# Altium schematic sheet SMC1940-A.SCHDOC
size A2
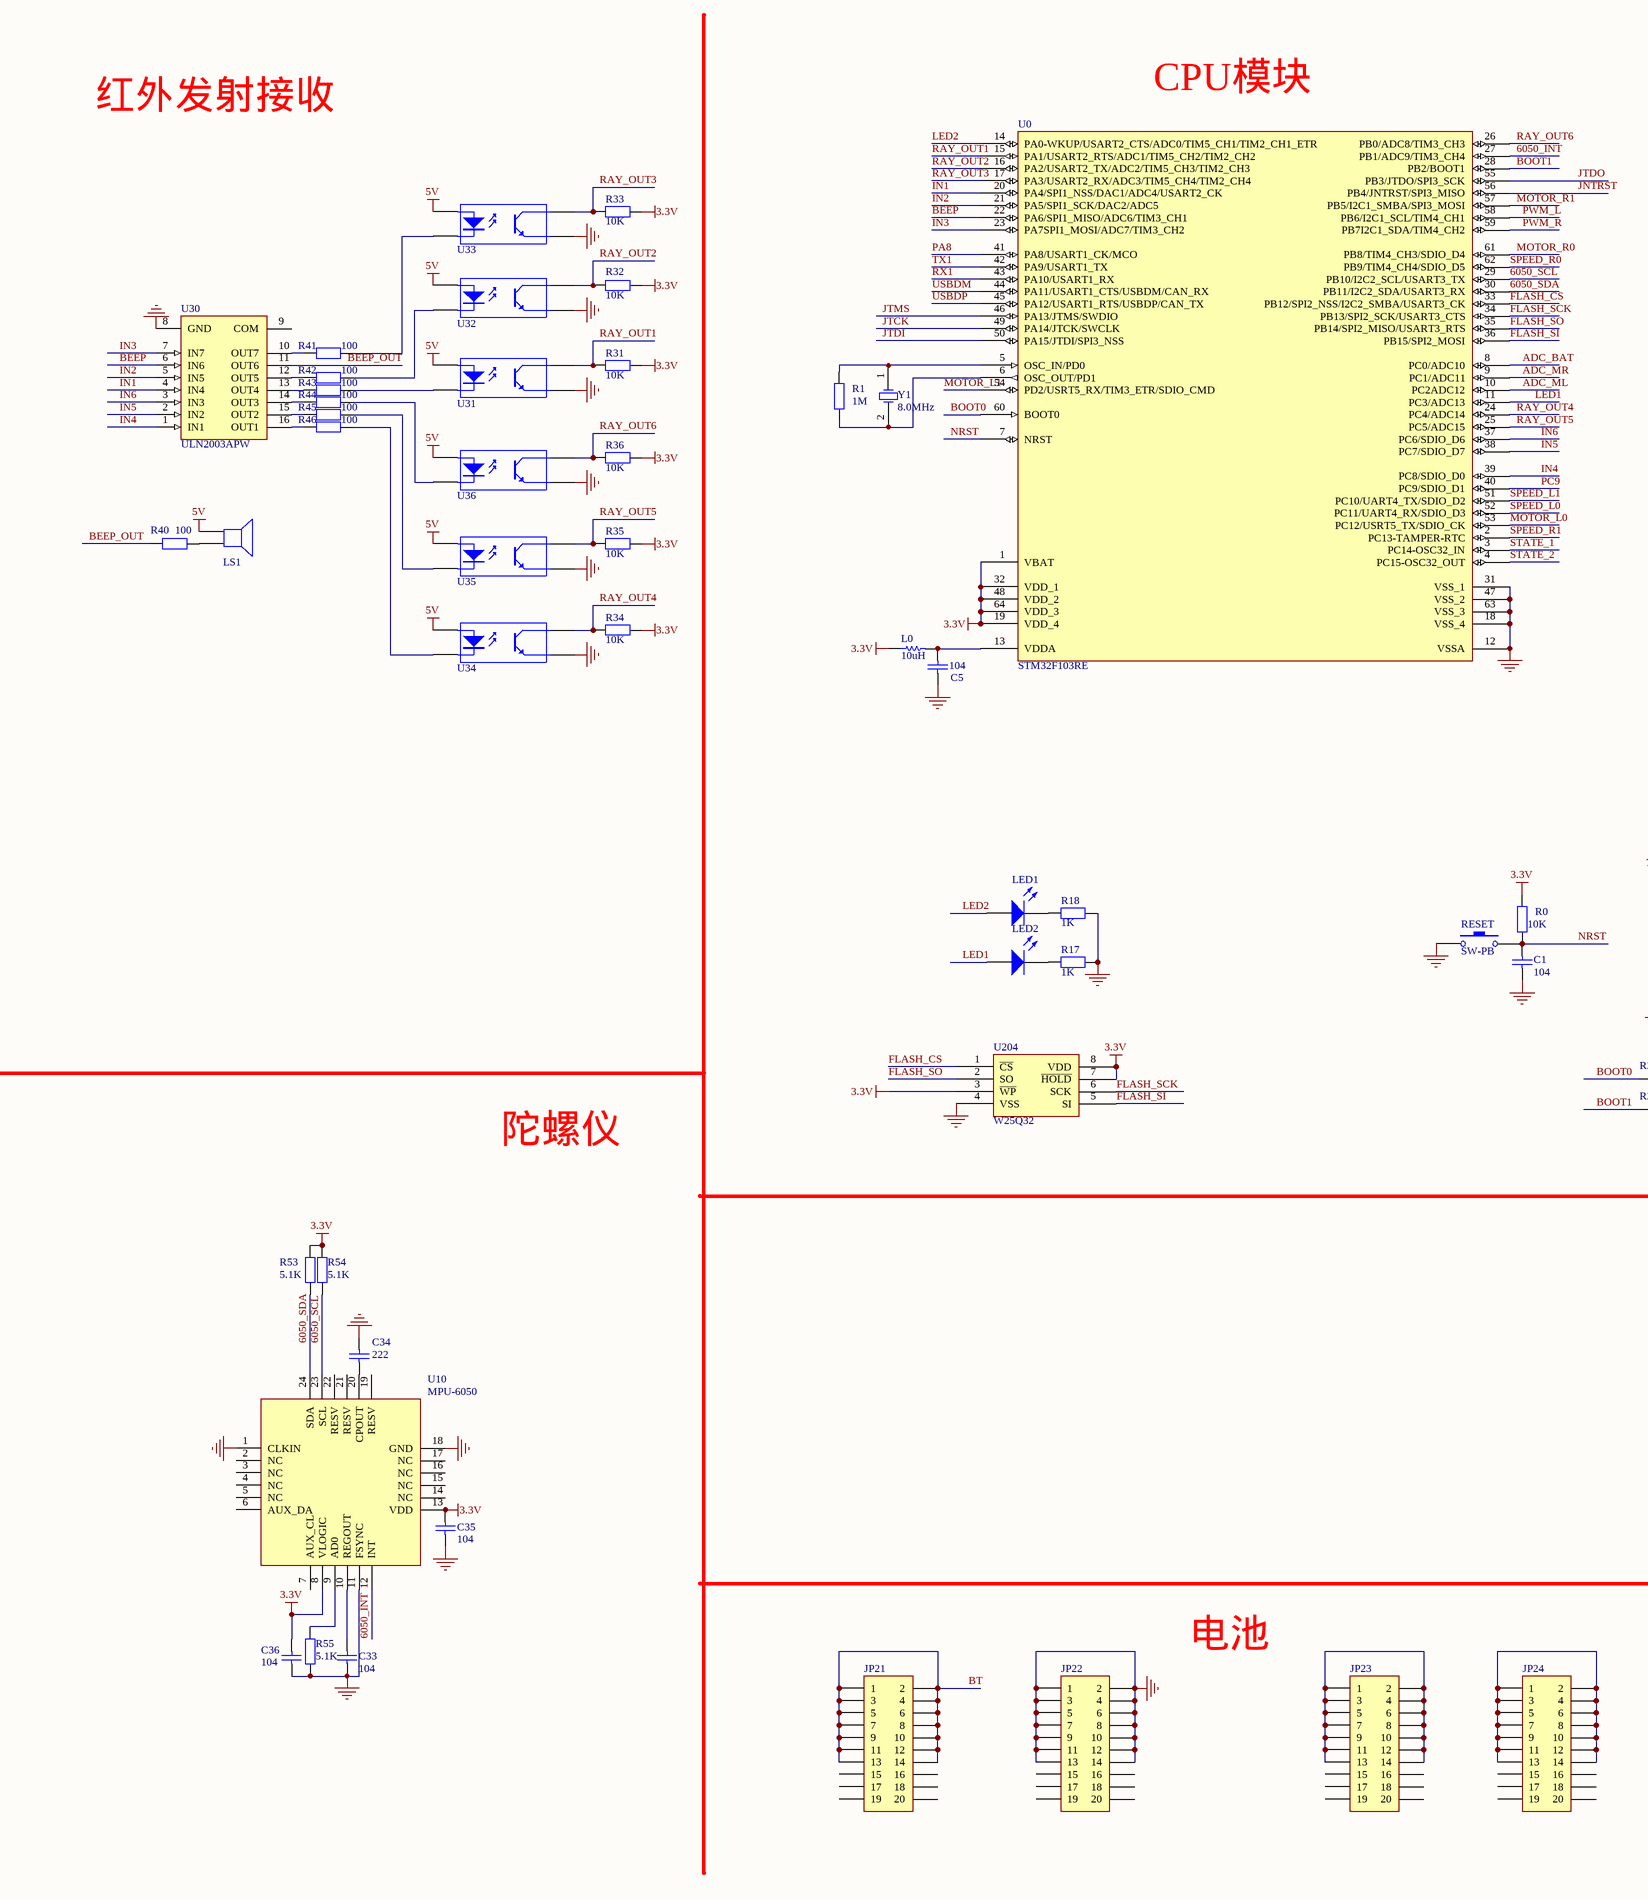
[diagram p0: SMC1940-A.SCHDOC, left]
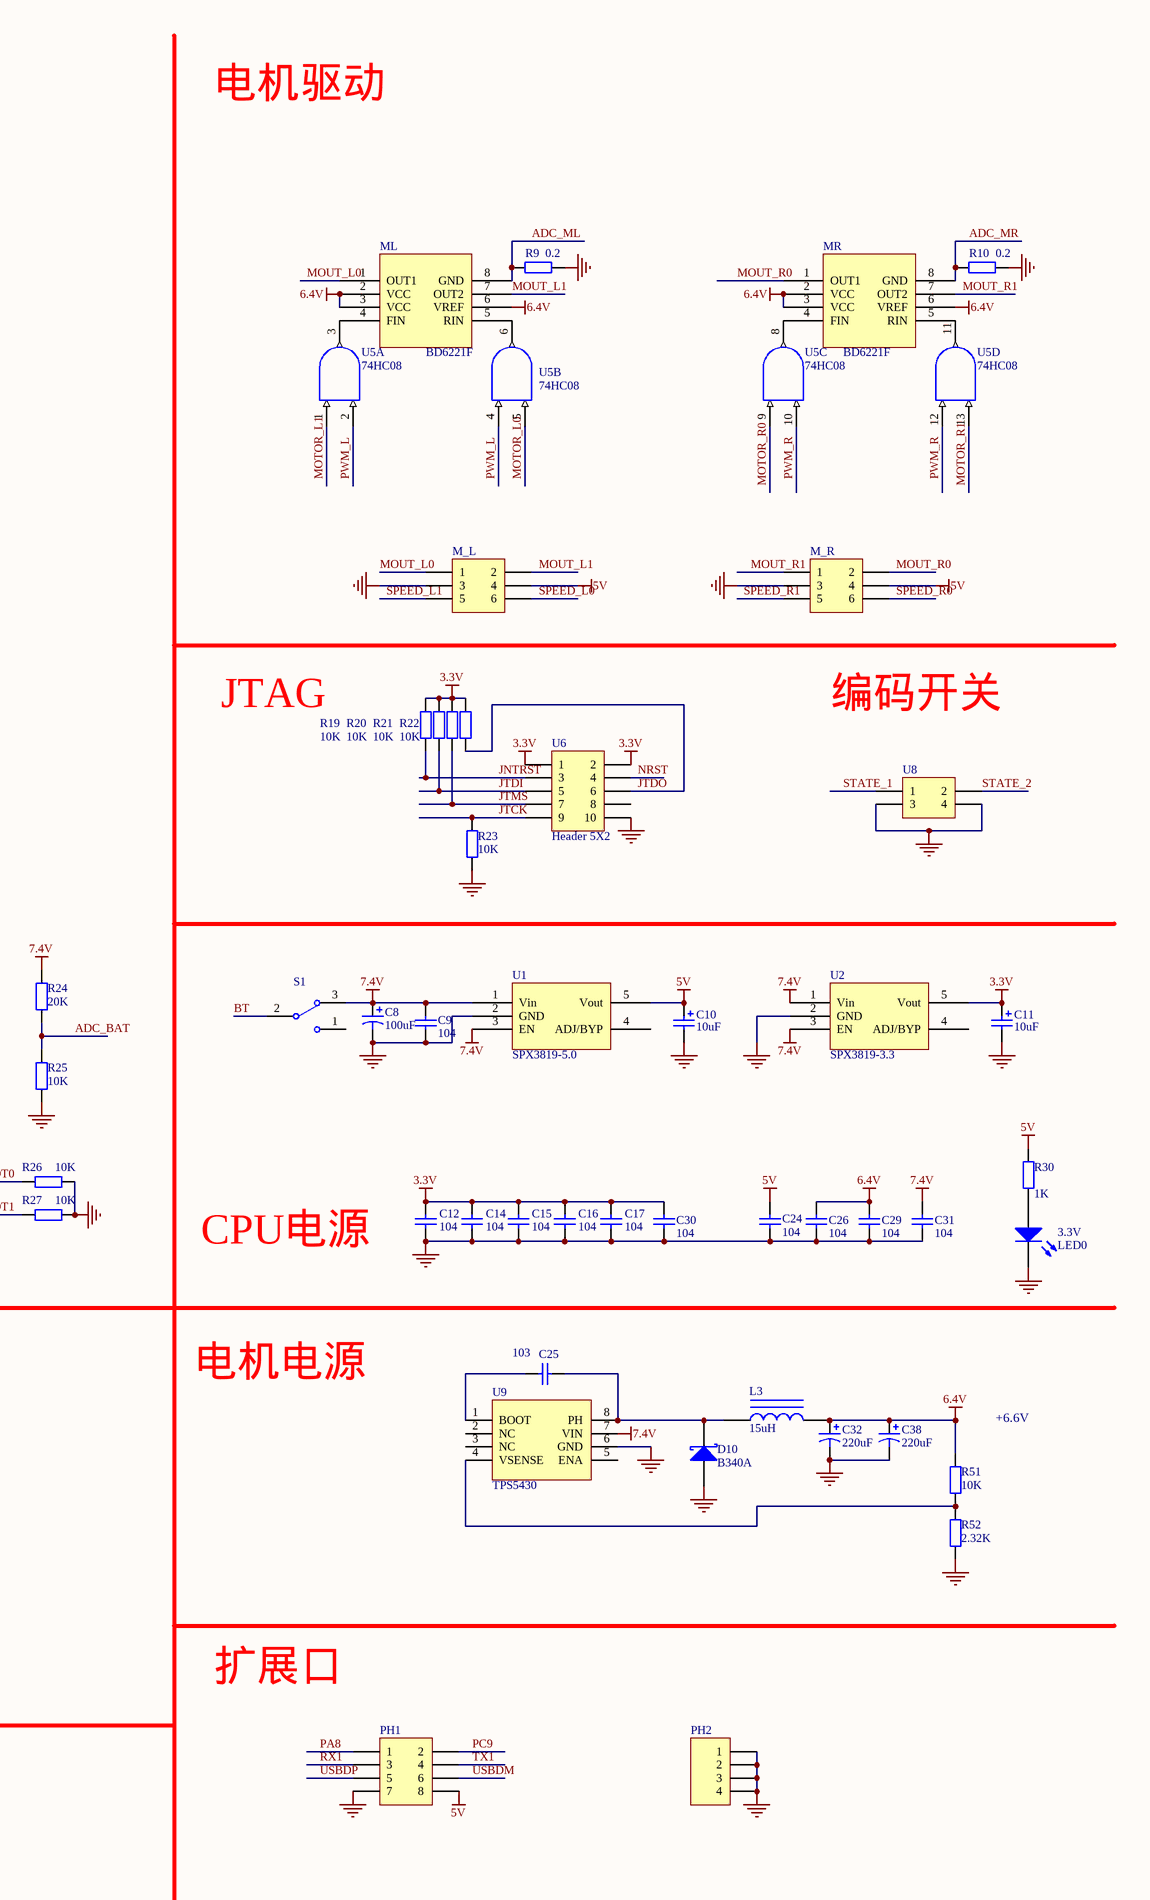
[diagram p1: SMC1940-A.SCHDOC, right]

## Parts
3.3V  LED0  [YU-SMD0603]
C1  104  [YU-SMD0603]
C5  104  [YU-SMD0603]
C8  100uF  [CAPPR2.5-6.3X5]
C9  104  [YU-SMD0603]
C10  value 10uF  [YU-SMD0805]
C11  value 10uF  [YU-SMD0805]
C12  104  [YU-SMD0603]
C14  104  [YU-SMD0603]
C15  104  [YU-SMD0603]
C16  104  [YU-SMD0603]
C17  104  [YU-SMD0603]
C24  104  [YU-SMD0603]
C25  103  [YU-SMD0603]
C26  104  [YU-SMD0603]
C29  104  [YU-SMD0603]
C30  104  [YU-SMD0603]
C31  104  [YU-SMD0603]
C32  220uF  [CAPPR2.5-6.3X5]
C33  104  [YU-SMD0603]
C34  222  [YU-SMD0603]
C35  104  [YU-SMD0603]
C36  104  [YU-SMD0603]
C38  220uF  [CAPPR2.5-6.3X5]
D10  B340A  [DO-214]
JP21  (no value)  [MSHDR2X10]
JP22  (no value)  [MSHDR2X10]
JP23  (no value)  [MSHDR2X10]
JP24  (no value)  [MSHDR2X10]
L0  10uH  [YU-SMD0603]
L3  15uH  [HC0603]
LED1  LED0  [YU-SMD0603]  (value not drawn)
LED2  (no value)  [YU-SMD0603]
LS1  (no value)  [蜂鸣器5020]
M_L  (no value)  [DC3-6PS]
M_R  (no value)  [DC3-6PS]
ML  BD6221F  [SO-G8]
MR  BD6221F  [SO-G8]
PH1  (no value)  [HDR2X4]
PH2  Header 4  [HDR1X4]  (value not drawn)
R0  10K  [YU-SMD0603]
R1  1M  [YU-SMD0603]
R9  0.2  [YU-SMD1206]
R10  0.2  [YU-SMD1206]
R17  value 1K  [YU-SMD0603]
R18  value 1K  [YU-SMD0603]
R19  10K  [YU-SMD0603]
R20  10K  [YU-SMD0603]
R21  10K  [YU-SMD0603]
R22  10K  [YU-SMD0603]
R23  10K  [YU-SMD0603]
R24  20K  [YU-SMD0603]
R25  10K  [YU-SMD0603]
R26  10K  [YU-SMD0603]
R27  10K  [YU-SMD0603]
R30  value 1K  [YU-SMD0603]
R31  10K  [YU-SMD0603]
R32  10K  [YU-SMD0603]
R33  10K  [YU-SMD0603]
R34  10K  [YU-SMD0603]
R35  10K  [YU-SMD0603]
R36  10K  [YU-SMD0603]
R40  100  [YU-SMD0805]
R41  100  [YU-SMD0805]
R42  100  [YU-SMD0805]
R43  100  [YU-SMD0805]
R44  100  [YU-SMD0805]
R45  100  [YU-SMD0805]
R46  100  [YU-SMD0805]
R51  10K  [YU-SMD0603]
R52  2.32K  [YU-SMD0603]
R53  5.1K  [YU-SMD0603]
R54  5.1K  [YU-SMD0603]
R55  5.1K  [YU-SMD0603]
RESET  SW-PB  [KEY3*6C]
S1  (no value)  [SWITCH_L]
U0  STM32F103RE  [LQFP64_N]
U1  SPX3819-5.0  [YU-SOT23-5]
U2  SPX3819-3.3  [YU-SOT23-5]
U5  74HC08  [TSSO5x6-G14/X.3]  (parts A,B,C,D of 4)
U6  Header 5X2  [DownLoad2-2*5]
U8  (no value)  [SW-2]
U9  TPS5430  [SO-G8]
U10  MPU-6050  [QFN-24]
U30  ULN2003APW  [TSSO5x6-G16]
U31  (no value)  [F5-2]
U32  (no value)  [F5-2]
U33  (no value)  [F5-2]
U34  (no value)  [F5-2]
U35  (no value)  [F5-2]
U36  (no value)  [F5-2]
U204  W25Q32  [sop8]
Y1  value 8.0MHz  [晶振3213]  (hidden comment: XTAL)

## Nets
3.3V: C11.1 C12.2 C14.2 C15.2 C16.2 C17.2 C30.1 C35.1 C36.1 L0.1 R0.2 R19.2 R20.2 R21.2 R22.2 R31.1 R32.1 R33.1 R34.1 R35.1 R36.1 R53.2 R54.2 U0.1(VBAT) U0.19(VDD_4) U0.32(VDD_1) U0.48(VDD_2) U0.64(VDD_3) U2.5(Vout) U6.1 U6.2 U10.8(VLOGIC) U10.13(VDD) U204.3(~{WP}) U204.7(~{HOLD}) U204.8(VDD)
5V: C10.1 C24.2 LS1.1 M_L.4 M_R.4 PH1.8 R30.2 U1.5(Vout) U31.1(A) U32.1(A) U33.1(A) U34.1(A) U35.1(A) U36.1(A)
6.4V: C26.1 C29.1 C32.1 C38.1 L3.2 ML.2(VCC) ML.3(VCC) ML.6(VREF) MR.2(VCC) MR.3(VCC) MR.6(VREF) R51.2
7.4V: C8.1 C9.2 C31.1 R24.2 S1.3 U1.1(Vin) U1.3(EN) U2.1(Vin) U2.3(EN) U9.7(VIN)
GND: 3.3V.2(K) C1.1 C5.1 C8.2 C9.1 C10.2 C11.2 C12.1 C14.1 C15.1 C16.1 C17.1 C24.1 C26.2 C29.2 C30.2 C31.2 C32.2 C33.2 C34.1 C35.2 C36.2 C38.2 D10.1(A) JP22.1 JP22.2 JP22.3 JP22.4 JP22.5 JP22.6 JP22.7 JP22.8 JP22.9 JP22.10 JP22.11 JP22.12 JP22.13 JP22.14 M_L.3 M_R.3 PH1.7 PH2.1 PH2.2 PH2.3 PH2.4 R9.2 R10.2 R17.2 R18.2 R23.1 R25.1 R26.2 R27.2 R52.1 R55.1 RESET.2 U0.12(VSSA) U0.18(VSS_4) U0.31(VSS_1) U0.47(VSS_2) U0.63(VSS_3) U1.2(GND) U2.2(GND) U5.7(GND) U6.10 U8.3 U8.4 U9.6(GND) U10.1(CLKIN) U10.11(FSYNC) U10.18(GND) U30.8(GND) U31.3(E) U32.3(E) U33.3(E) U34.3(E) U35.3(E) U36.3(E) U204.4(VSS)
VDD: U5.14(VDD)
6050_INT: U0.27(PB1/ADC9/TIM3_CH4) U10.12(INT)
6050_SCL: R54.1 U0.29(PB10/I2C2_SCL/USART3_TX) U10.23(SCL)
6050_SDA: R53.1 U0.30(PB11/I2C2_SDA/USART3_RX) U10.24(SDA)
ADC_BAT: R24.1 R25.2 U0.8(PC0/ADC10)
ADC_ML: ML.8(GND) R9.1 U0.10(PC2ADC12)
ADC_MR: MR.8(GND) R10.1 U0.9(PC1/ADC11)
BEEP: U0.22(PA6/SPI1_MISO/ADC6/TIM3_CH1) U30.6(IN6)
BEEP_OUT: R40.1 U30.11(OUT6)
BOOT0: R26.1 U0.60(BOOT0)
BOOT1: R27.1 U0.28(PB2/BOOT1)
BT: JP21.1 JP21.2 JP21.3 JP21.4 JP21.5 JP21.6 JP21.7 JP21.8 JP21.9 JP21.10 JP21.11 JP21.12 JP21.13 JP21.14 S1.2
FLASH_CS: U0.33(PB12/SPI2_NSS/I2C2_SMBA/USART3_CK) U204.1(~{CS})
FLASH_SCK: U0.34(PB13/SPI2_SCK/USART3_CTS) U204.6(SCK)
FLASH_SI: U0.36(PB15/SPI2_MOSI) U204.5(SI)
FLASH_SO: U0.35(PB14/SPI2_MISO/USART3_RTS) U204.2(SO)
IN1: U0.20(PA4/SPI1_NSS/DAC1/ADC4/USART2_CK) U30.4(IN4)
IN2: U0.21(PA5/SPI1_SCK/DAC2/ADC5) U30.5(IN5)
IN3: U0.23(PA7SPI1_MOSI/ADC7/TIM3_CH2) U30.7(IN7)
IN4: U0.39(PC8/SDIO_D0) U30.1(IN1)
IN5: U0.38(PC7/SDIO_D7) U30.2(IN2)
IN6: U0.37(PC6/SDIO_D6) U30.3(IN3)
JNTRST: R19.1 U0.56(PB4/JNTRST/SPI3_MISO) U6.3
JTCK: R23.2 U0.49(PA14/JTCK/SWCLK) U6.9
JTDI: R20.1 U0.50(PA15/JTDI/SPI3_NSS) U6.5
JTDO: R22.1 U0.55(PB3/JTDO/SPI3_SCK) U6.6
JTMS: R21.1 U0.46(PA13/JTMS/SWDIO) U6.7
LED1: LED2.1(A) U0.11(PC3/ADC13)
LED2: LED1.1(A) U0.14(PA0-WKUP/USART2_CTS/ADC0/TIM5_CH1/TIM2_CH1_ETR)
MOTOR_L0: U0.53(PC12/USRT5_TX/SDIO_CK) U5.5(B)
MOTOR_L1: U0.54(PD2/USRT5_RX/TIM3_ETR/SDIO_CMD) U5.1(A)
MOTOR_R0: U0.61(PB8/TIM4_CH3/SDIO_D4) U5.9(A)
MOTOR_R1: U0.57(PB5/I2C1_SMBA/SPI3_MOSI) U5.13(B)
MOUT_L0: M_L.1 ML.1(OUT1)
MOUT_L1: M_L.2 ML.7(OUT2)
MOUT_R0: M_R.2 MR.1(OUT1)
MOUT_R1: M_R.1 MR.7(OUT2)
NRST: C1.2 R0.1 RESET.1 U0.7(NRST) U6.4
PA8: PH1.1 U0.41(PA8/USART1_CK/MCO)
PC9: PH1.2 U0.40(PC9/SDIO_D1)
PWM_L: U0.58(PB6/I2C1_SCL/TIM4_CH1) U5.2(B) U5.4(A)
PWM_R: U0.59(PB7I2C1_SDA/TIM4_CH2) U5.10(B) U5.12(A)
RAY_OUT1: R31.2 U0.15(PA1/USART2_RTS/ADC1/TIM5_CH2/TIM2_CH2) U31.4(C)
RAY_OUT2: R32.2 U0.16(PA2/USART2_TX/ADC2/TIM5_CH3/TIM2_CH3) U32.4(C)
RAY_OUT3: R33.2 U0.17(PA3/USART2_RX/ADC3/TIM5_CH4/TIM2_CH4) U33.4(C)
RAY_OUT4: R34.2 U0.24(PC4/ADC14) U34.4(C)
RAY_OUT5: R35.2 U0.25(PC5/ADC15) U35.4(C)
RAY_OUT6: R36.2 U0.26(PB0/ADC8/TIM3_CH3) U36.4(C)
RX1: PH1.3 U0.43(PA10/USART1_RX)
SPEED_L0: M_L.6 U0.52(PC11/UART4_RX/SDIO_D3)
SPEED_L1: M_L.5 U0.51(PC10/UART4_TX/SDIO_D2)
SPEED_R0: M_R.6 U0.62(PB9/TIM4_CH4/SDIO_D5)
SPEED_R1: M_R.5 U0.2(PC13-TAMPER-RTC)
STATE_1: U0.3(PC14-OSC32_IN) U8.1
STATE_2: U0.4(PC15-OSC32_OUT) U8.2
TX1: PH1.4 U0.42(PA9/USART1_TX)
USBDM: PH1.6 U0.44(PA11/USART1_CTS/USBDM/CAN_RX)
USBDP: PH1.5 U0.45(PA12/USART1_RTS/USBDP/CAN_TX)
Net3.3V_1: 3.3V.1(A) R30.1
NetC5_2: C5.2 L0.2 U0.13(VDDA)
NetC25_1: C25.1 D10.2(K) L3.1 U9.8(PH)
NetC25_2: C25.2 U9.1(BOOT)
NetC33_1: C33.1 U10.10(REGOUT)
NetC34_2: C34.2 U10.20(CPOUT)
NetJP23_1: JP23.1 JP23.2 JP23.3 JP23.4 JP23.5 JP23.6 JP23.7 JP23.8 JP23.9 JP23.10 JP23.11 JP23.12 JP23.13 JP23.14
NetJP24_1: JP24.1 JP24.2 JP24.3 JP24.4 JP24.5 JP24.6 JP24.7 JP24.8 JP24.9 JP24.10 JP24.11 JP24.12 JP24.13 JP24.14
NetLED1_2: LED1.2(K) R18.1
NetLED2_2: LED2.2(K) R17.1
NetLS1_2: LS1.2 R40.2
NetML_4: ML.4(FIN) U5.3(Y)
NetML_5: ML.5(RIN) U5.6(Y)
NetMR_4: MR.4(FIN) U5.8(Y)
NetMR_5: MR.5(RIN) U5.11(Y)
NetR1_1: R1.1 U0.6(OSC_OUT/PD1) Y1.2(OSC2)
NetR1_2: R1.2 U0.5(OSC_IN/PD0) Y1.1(OSC1)
NetR41_1: R41.1 U30.10(OUT7)
NetR41_2: R41.2 U33.2(K)
NetR42_1: R42.1 U30.12(OUT5)
NetR42_2: R42.2 U32.2(K)
NetR43_1: R43.1 U30.13(OUT4)
NetR43_2: R43.2 U31.2(K)
NetR44_1: R44.1 U30.14(OUT3)
NetR44_2: R44.2 U36.2(K)
NetR45_1: R45.1 U30.15(OUT2)
NetR45_2: R45.2 U35.2(K)
NetR46_1: R46.1 U30.16(OUT1)
NetR46_2: R46.2 U34.2(K)
NetR51_1: R51.1 R52.2 U9.4(VSENSE)
NetR55_2: R55.2 U10.9(AD0)

Not connected (* = marked no-connect by the designer): JP21 15 16 17 18 19 20; JP22 15 16 17 18 19 20; JP23 15 16 17 18 19 20; JP24 15 16 17 18 19 20; S1 1; U1 4(ADJ/BYP); U2 4(ADJ/BYP); U6 8; U9 2(NC) 3(NC) 5(ENA); U10 2(NC) 3(NC) 4(NC) 5(NC) 6(AUX_DA) 7(AUX_CL) 14(NC) 15(NC) 16(NC) 17(NC) 19(RESV) 21(RESV) 22(RESV); U30 9(COM)

## Notes on the sheet
- 电机驱动
- 红外发射接收
- (near U0) CPU模块
- JTAG
- 编码开关
- 陀螺仪
- CPU电源
- 电机电源
- +6.6V
- 扩展口
- 电池

## Library data of the parts
3.3V LED1 LED2 = LED0: Typical INFRARED GaAs LED; Published: 8-Jun-2000; LatestRevisionDate: 08-Jul-2005; LatestRevisionNote: Mech Layer 1 removed.; PackageReference: LED-0; Publisher: Altium Limited
C1 C9 C12 C14-C17 C24 C26 C29-C31 C33 C35 C36 = Cap: Capacitor; Published: 8-Jun-2000; Publisher: Altium Limited; Value: 104
  C1 C9 C24 C26 C29-C31 C33 C35 C36: LatestRevisionDate: 17-Jul-2002; LatestRevisionNote: Re-released for DXP Platform.; PackageReference: RAD-0.3
  C12 C14-C17: Revision: July-2002: Re-released for DXP Platform.
C5 = Cap: Capacitor; Value: 100pF; Published: 8-Jun-2000; Revision: July-2002: Re-released for DXP Platform.; Publisher: Altium Limited
C8 C32 C38 = Cap Pol2: Polarized Capacitor (Axial); Value: 100pF; Published: 8-Jun-2000; Revision: July-2002: Re-released for DXP Platform.; Publisher: Altium Limited
C10 C11 = Cap Pol1: Polarized Capacitor (Radial); Manufacturer: Generic Components; Class: Passive; Published: 08/06/2000; Publisher: Altium Hobart Technology Centre; SubClass: Capacitor
C25 C34 = Cap: Capacitor; Value: 104; Published: 8-Jun-2000; LatestRevisionDate: 17-Jul-2002; LatestRevisionNote: Re-released for DXP Platform.; PackageReference: RAD-0.3; Publisher: Altium Limited
D10 = Diode 11DQ03: Schottky Rectifier; Revision 1: 10-Jul-2000: SIM Model Added.; Revision 2: 17-Jul-2002: Re-released for DXP Platform.; Code - JEDEC: DO-204-AL; Published: 8-Jun-2000; Datasheet: Latest Revision: Dec-1997; Package Reference: DO-204AL; Publisher: Altium Limited
JP21-JP24 = MHDR2X10: Header, 10-Pin, Dual row; Revision: 17-Jul-2002: Re-released for DXP Platform.; Publisher: Altium Limited
L0 = Res1: Resistor; Value: 1K; Published: 8-Jun-2000; Revision: July-2002: Re-released for DXP Platform.; Publisher: Altium Limited
L3 = Inductor Iron: Magnetic-Core Inductor; Value: 10mH; Published: 24-Mar-1999; Revision: July-2002: Re-released for DXP Platform.; Publisher: Altium Limited
LS1 = Speaker: Loudspeaker; Published: 24-Mar-1999; Revision: July-2002: Re-released for DXP Platform.; Publisher: Altium Limited
M_L M_R = Header 3X2: Header, 3-Pin, Dual row; Revision: 17-Jul-2002: Re-released for DXP Platform.; Publisher: Altium Limited
PH1 = Header 4X2: Header, 4-Pin, Dual row; Revision: 17-Jul-2002: Re-released for DXP Platform.; Publisher: Altium Limited
PH2 = Header 4: Header, 4-Pin; Revision: 17-Jul-2002: Re-released for DXP Platform.; Publisher: Altium Limited
R0 R17 R18 R30 = Res2: Resistor; Published: 8-Jun-2000; LatestRevisionDate: 17-Jul-2002; LatestRevisionNote: Re-released for DXP Platform.; PackageReference: AXIAL-0.4; Publisher: Altium Limited
  R0: Value: 10K
R1 R9 R10 R19-R27 R31-R36 R40-R46 R51-R55 = Res2: Resistor; Value: 1K; Published: 8-Jun-2000; Publisher: Altium Limited
  R1 R26 R27 R51-R55: LatestRevisionDate: 17-Jul-2002; LatestRevisionNote: Re-released for DXP Platform.; PackageReference: AXIAL-0.4
  R9 R10 R19-R25 R31-R36 R40-R46: Revision: July-2002: Re-released for DXP Platform.
RESET = SW-PB: Switch; Published: 24-Mar-1999; LatestRevisionDate: 17-Jul-2002; LatestRevisionNote: Re-released for DXP Platform.; PackageReference: SPST-2; Publisher: Altium Limited
S1 = SW-SPDT: SPDT Subminiature Toggle Switch, Right Angle Mounting, Vertical Actuation; Revision 1: Jul-2002: Re-released for DXP Platform.; Revision 2: 17-Dec-2003: Schematic revised, PCB Footprint replaced.; Published: 24-Mar-1999; Datasheet: Latest Revision: 05-Dec-2000; Publisher: Altium Limited
U0 = STM32F101RC: STM32 ARM-based 32-bit MCU with 128 Kbytes Flash, 64-pin LQFP, Industrial Temperature; Published: *; DatasheetVersion: *; PackageVersion: *; PackageReference: *; Publisher: *; PackageDescription: *; ComponentLink1Description: *; ComponentLink1URL: *; ComponentLink2Description: *; ComponentLink2URL: *
U1 U2 = SP6201
U5 = MC74HC08AD: Quad 2-Input AND Gate; Package Information: Latest Revision: 1991; Published: 17-Jul-2002; Datasheet: High-Speed CMOS Logic Data, DL129 Rev4 (1989); Package Reference: 751A-02; Publisher: Altium Limited
U6 = Header 5X2: Header, 5-Pin, Dual row; Revision: 17-Jul-2002: Re-released for DXP Platform.; Publisher: Altium Limited
U8 = Header 2X2: Header, 2-Pin, Dual row; Revision: 17-Jul-2002: Re-released for DXP Platform.; Publisher: Altium Limited
U9 = TPS2430
U30 = ULN2003D: Seven Darlington Array; Package Information: Latest Revision: Jan-1997; Published: 8-Jun-2000; Revision: 17-Jul-2002: Re-released for DXP Platform.; Datasheet: Latest Revision: Sep-1998; Package Reference: SO16; Publisher: Altium Limited
U31-U36 = 光耦2
U204 = FM25H20
Y1 = XTAL: Crystal Oscillator; Published: 8-Jun-2000; LatestRevisionDate: 17-Jul-2002; LatestRevisionNote: Re-released for DXP Platform.; PackageReference: R38; Publisher: Altium Limited